# EAGLE schematic Faulty TL072 detector (EAGLE 7.6.0)
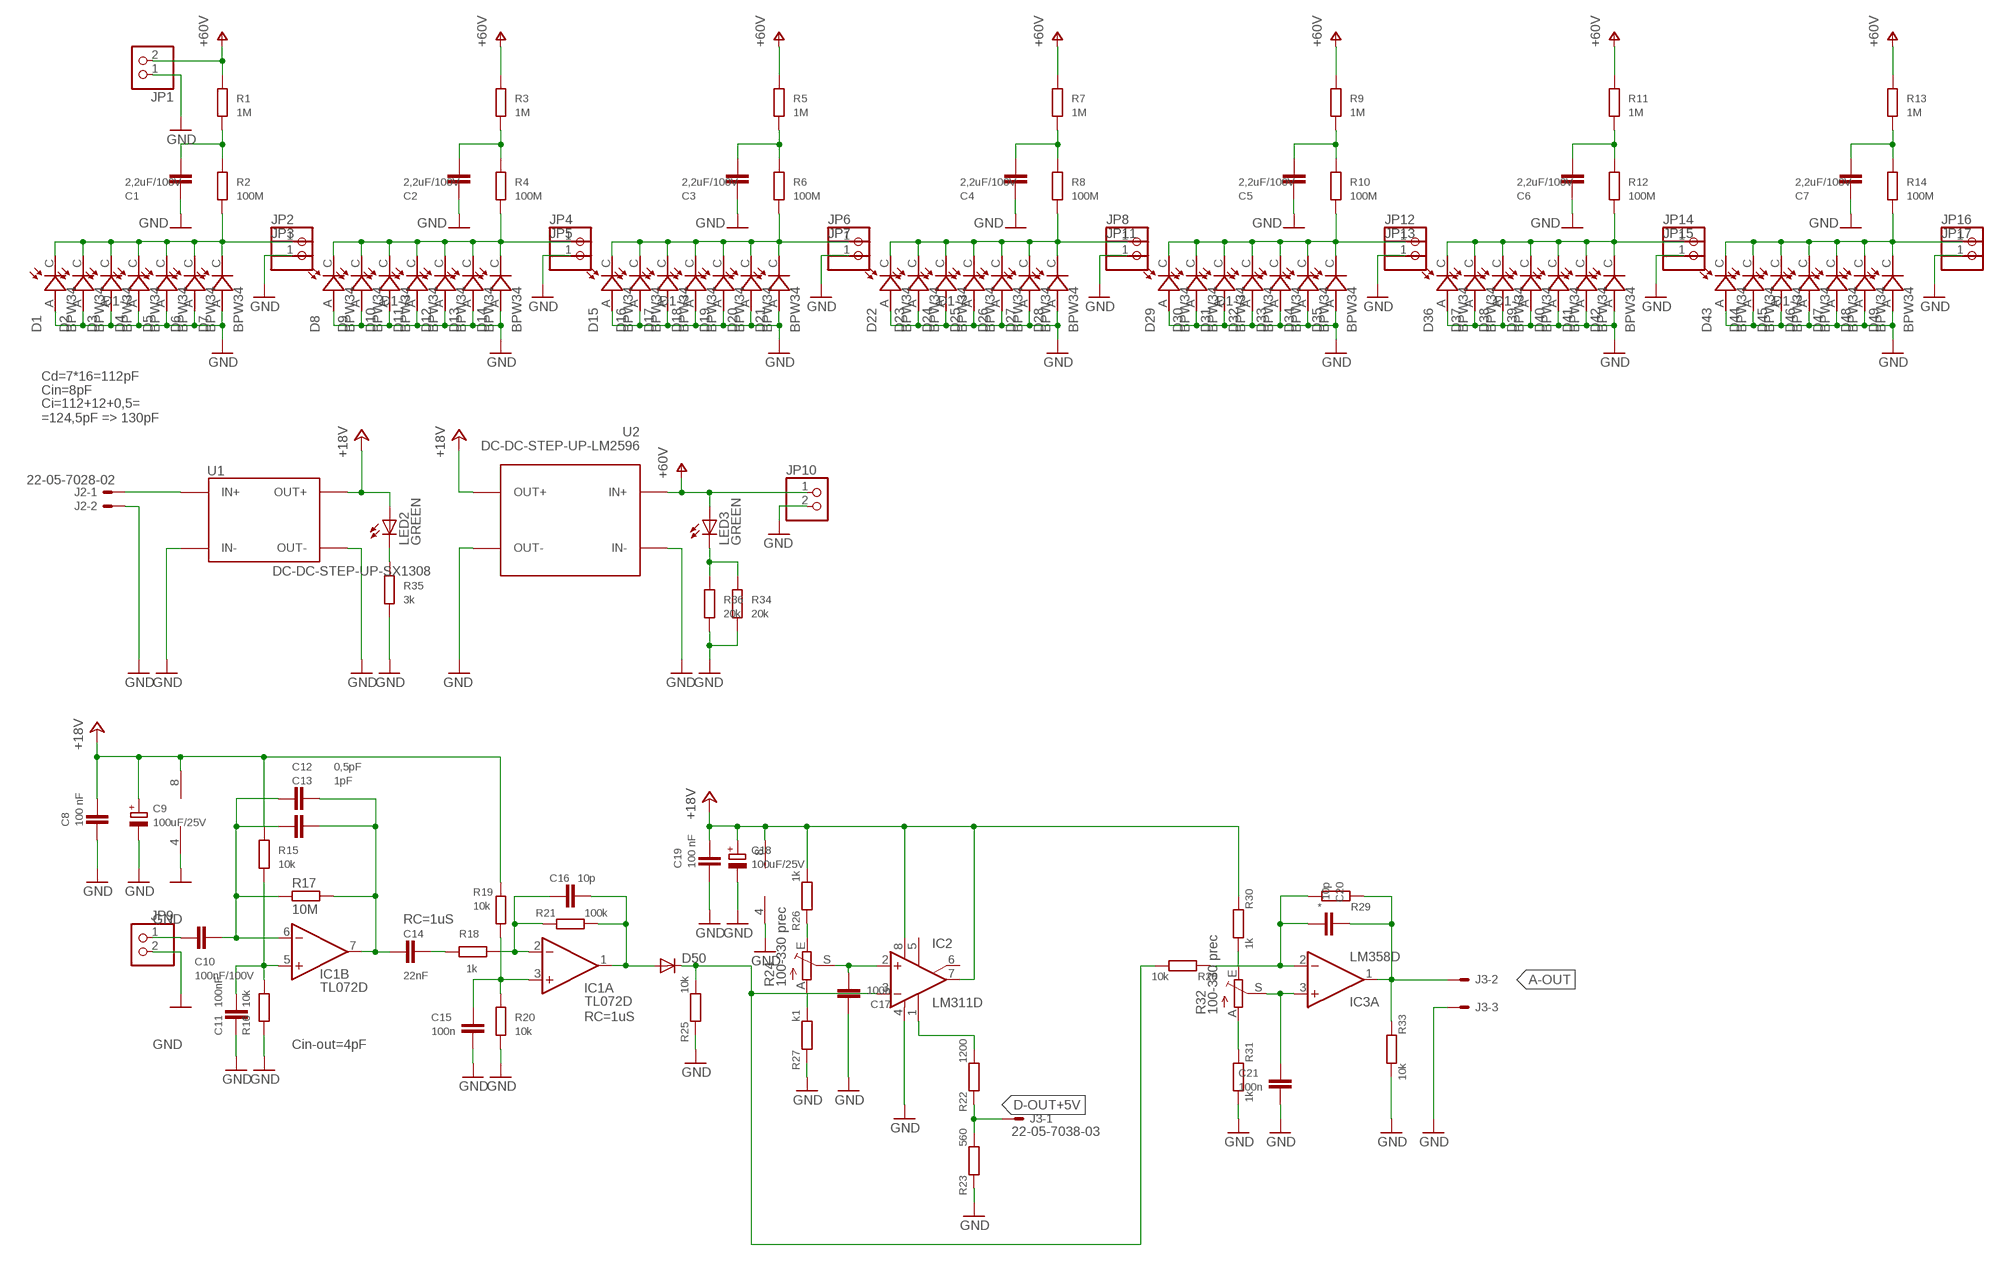
[diagram p0: schematic, sheet 1]

## Parts
C1  2,2uF/100V  C2824  [2824]
C2  2,2uF/100V  C2824  [2824]
C3  2,2uF/100V  C2824  [2824]
C4  2,2uF/100V  C2824  [2824]
C5  2,2uF/100V  C2824  [2824]
C6  2,2uF/100V  C2824  [2824]
C7  2,2uF/100V  C2824  [2824]
C8  100 nF  C-EUC0805  [C0805]
C9  100uF/25V  CPOL-EUSMCD  [SMC_D]
C10  100nF/100V  C-EUC1206  [C1206]
C11  100nF  C-EUC0805  [C0805]
C12  0,5pF  C-EUC0603  [C0603]
C13  1pF  C-EUC0805  [C0805]
C14  22nF  C-EUC0805  [C0805]
C15  100n  C-EUC0805  [C0805]
C16  10p  C-EUC0805  [C0805]
C17  100n  C-EUC0805  [C0805]
C18  100uF/25V  CPOL-EUSMCD  [SMC_D]
C19  100 nF  C-EUC0805  [C0805]
C20  10p  C-EUC0805  [C0805]
C21  100n  C-EUC0805  [C0805]
D1  BPW34  [PHODET_BPW34]
D2  BPW34  [PHODET_BPW34]
D3  BPW34  [PHODET_BPW34]
D4  BPW34  [PHODET_BPW34]
D5  BPW34  [PHODET_BPW34]
D6  BPW34  [PHODET_BPW34]
D7  BPW34  [PHODET_BPW34]
D8  BPW34  [PHODET_BPW34]
D9  BPW34  [PHODET_BPW34]
D10  BPW34  [PHODET_BPW34]
D11  BPW34  [PHODET_BPW34]
D12  BPW34  [PHODET_BPW34]
D13  BPW34  [PHODET_BPW34]
D14  BPW34  [PHODET_BPW34]
D15  BPW34  [PHODET_BPW34]
D16  BPW34  [PHODET_BPW34]
D17  BPW34  [PHODET_BPW34]
D18  BPW34  [PHODET_BPW34]
D19  BPW34  [PHODET_BPW34]
D20  BPW34  [PHODET_BPW34]
D21  BPW34  [PHODET_BPW34]
D22  BPW34  [PHODET_BPW34]
D23  BPW34  [PHODET_BPW34]
D24  BPW34  [PHODET_BPW34]
D25  BPW34  [PHODET_BPW34]
D26  BPW34  [PHODET_BPW34]
D27  BPW34  [PHODET_BPW34]
D28  BPW34  [PHODET_BPW34]
D29  BPW34  [PHODET_BPW34]
D30  BPW34  [PHODET_BPW34]
D31  BPW34  [PHODET_BPW34]
D32  BPW34  [PHODET_BPW34]
D33  BPW34  [PHODET_BPW34]
D34  BPW34  [PHODET_BPW34]
D35  BPW34  [PHODET_BPW34]
D36  BPW34  [PHODET_BPW34]
D37  BPW34  [PHODET_BPW34]
D38  BPW34  [PHODET_BPW34]
D39  BPW34  [PHODET_BPW34]
D40  BPW34  [PHODET_BPW34]
D41  BPW34  [PHODET_BPW34]
D42  BPW34  [PHODET_BPW34]
D43  BPW34  [PHODET_BPW34]
D44  BPW34  [PHODET_BPW34]
D45  BPW34  [PHODET_BPW34]
D46  BPW34  [PHODET_BPW34]
D47  BPW34  [PHODET_BPW34]
D48  BPW34  [PHODET_BPW34]
D49  BPW34  [PHODET_BPW34]
D50  DIODE-SOD323-W  [SOD323-W]
IC1  TL072D  [SO08]
IC2  LM311D  [SO08]
IC3  LM358D  [SO08]
J2  22-05-7028-02  [7395-02]
J3  22-05-7038-03  [7395-03]
JP1  PINHD-1X2  [1X02]
JP2  PINHD-1X1  [1X01]
JP3  PINHD-1X1  [1X01]
JP4  PINHD-1X1  [1X01]
JP5  PINHD-1X1  [1X01]
JP6  PINHD-1X1  [1X01]
JP7  PINHD-1X1  [1X01]
JP8  PINHD-1X1  [1X01]
JP9  PINHD-1X2  [1X02]
JP10  PINHD-1X2  [1X02]
JP11  PINHD-1X1  [1X01]
JP12  PINHD-1X1  [1X01]
JP13  PINHD-1X1  [1X01]
JP14  PINHD-1X1  [1X01]
JP15  PINHD-1X1  [1X01]
JP16  PINHD-1X1  [1X01]
JP17  PINHD-1X1  [1X01]
LED2  GREEN  LEDCHIPLED_1206  [CHIPLED_1206]
LED3  GREEN  LEDCHIPLED_1206  [CHIPLED_1206]
R1  1M  R-EU_M0805  [M0805]
R2  100M  R-EU_R0805  [R0805]
R3  1M  R-EU_M0805  [M0805]
R4  100M  R-EU_R0805  [R0805]
R5  1M  R-EU_M0805  [M0805]
R6  100M  R-EU_R0805  [R0805]
R7  1M  R-EU_M0805  [M0805]
R8  100M  R-EU_R0805  [R0805]
R9  1M  R-EU_M0805  [M0805]
R10  100M  R-EU_R0805  [R0805]
R11  1M  R-EU_M0805  [M0805]
R12  100M  R-EU_R0805  [R0805]
R13  1M  R-EU_M0805  [M0805]
R14  100M  R-EU_R0805  [R0805]
R15  10k  R-EU_R0805  [R0805]
R16  10k  R-EU_R0805  [R0805]
R17  10M  R-EU_R0805  [R0805]
R18  1k  R-EU_R0805  [R0805]
R19  10k  R-EU_R0805  [R0805]
R20  10k  R-EU_R0805  [R0805]
R21  100k  R-EU_R0805  [R0805]
R22  1200  R-EU_R0805  [R0805]
R23  560  R-EU_R0805  [R0805]
R24  100-330 prec  TRIM_EU-SP19L  [SP19L]
R25  10k  R-EU_R0805  [R0805]
R26  1k  R-EU_R0805  [R0805]
R27  k1  R-EU_R0805  [R0805]
R28  10k  R-EU_R0805  [R0805]
R29  *  R-EU_R0805  [R0805]
R30  1k  R-EU_R0805  [R0805]
R31  1k  R-EU_R0805  [R0805]
R32  100-330 prec  TRIM_EU-SP19L  [SP19L]
R33  10k  R-EU_R0805  [R0805]
R34  20k  R-EU_R0805  [R0805]
R35  3k  R-EU_R0805  [R0805]
R36  20k  R-EU_R0805  [R0805]
U1  DC-DC-STEP-UP-SX1308  [DC-DC-STEP-UP-SX1308]
U2  DC-DC-STEP-UP-LM2596  DC-DC-STEP-DOWN-LM2596  [DC-DC-STEP-DOWN-LM2596]

## Nets
+18V: C8.1 C9.+ C18.+ C19.1 IC1.8(P:V+) IC2.7(OUT) IC2.8(V+) IC3.8(P:V+) LED2.A R15.1 R19.1 R26.1 R30.2 U1.OUT+
+24V: U2.OUT+ ; supply symbol labelled +18V
+60: JP1.2 R1.1 R3.1 R5.1 R7.1 R9.1 R11.1 R13.1 ; supply symbol labelled +60V
+60V: JP10.1 LED3.A U2.IN+
A-OUT: C20.2 IC3.1(A:OUT) J3.2 R29.2 R33.2
D-OUT+5V: J3.1 R22.2 R23.1
GND: C1.2 C2.2 C3.2 C4.2 C5.2 C6.2 C7.2 C8.2 C9.- C11.1 C15.1 C17.2 C18.- C19.2 C21.1 D1.A D2.A D3.A D4.A D5.A D6.A D7.A D8.A D9.A D10.A D11.A D12.A D13.A D14.A D15.A D16.A D17.A D18.A D19.A D20.A D21.A D22.A D23.A D24.A D25.A D26.A D27.A D28.A D29.A D30.A D31.A D32.A D33.A D34.A D35.A D36.A D37.A D38.A D39.A D40.A D41.A D42.A D43.A D44.A D45.A D46.A D47.A D48.A D49.A IC1.4(P:V-) IC2.4(V-) IC3.4(P:V-) J2.2 J3.3 JP1.1 JP3.1 JP5.1 JP7.1 JP9.2 JP10.2 JP11.1 JP13.1 JP15.1 JP17.1 R16.2 R20.2 R23.2 R25.2 R27.2 R31.1 R33.1 R34.2 R35.2 R36.2 U1.IN- U1.OUT- U2.IN- U2.OUT-
N$1: C11.2 IC1.5(B:+IN) R15.2 R16.1
N$3: C12.1 C13.1 C14.1 IC1.7(B:OUT) R17.1
N$4: J2.1 U1.IN+
N$5: C1.1 R1.2 R2.1
N$6: C15.2 IC1.3(A:+IN) R19.2 R20.1
N$7: C14.2 R18.2
N$8: C10.2 C12.2 C13.2 IC1.6(B:-IN) R17.2
N$9: C16.2 IC1.2(A:-IN) R18.1 R21.2
N$10: C16.1 D50.A IC1.1(A:OUT) R21.1
N$12: C10.1 JP9.1
N$13: C2.1 R3.2 R4.1
N$14: C3.1 R5.2 R6.1
N$15: C4.1 R7.2 R8.1
N$16: C5.1 R9.2 R10.1
N$17: C6.1 R11.2 R12.1
N$18: C7.1 R13.2 R14.1
N$22: D50.C IC2.3(-IN) R25.1 R28.1
N$23: IC2.1(GND) R22.1
N$24: C20.1 IC3.2(A:-IN) R28.2 R29.1
N$25: C17.1 IC2.2(+IN) R24.S
N$26: R24.E R26.2
N$27: R24.A R27.1
N$29: R30.1 R32.E
N$30: R31.2 R32.A
N$31: C21.2 IC3.3(A:+IN) R32.S
N$32: LED2.C R35.1
N$34: LED3.C R34.1 R36.1
OUT: D1.C D2.C D3.C D4.C D5.C D6.C D7.C JP2.1 R2.2
OUT1: D8.C D9.C D10.C D11.C D12.C D13.C D14.C JP4.1 R4.2
OUT2: D15.C D16.C D17.C D18.C D19.C D20.C D21.C JP6.1 R6.2
OUT3: D22.C D23.C D24.C D25.C D26.C D27.C D28.C JP8.1 R8.2
OUT4: D29.C D30.C D31.C D32.C D33.C D34.C D35.C JP12.1 R10.2
OUT5: D36.C D37.C D38.C D39.C D40.C D41.C D42.C JP14.1 R12.2
OUT6: D43.C D44.C D45.C D46.C D47.C D48.C D49.C JP16.1 R14.2
Unconnected: IC2.5(ON) IC2.6(ON/STR) IC3.5(B:+IN) IC3.6(B:-IN) IC3.7(B:OUT)

## Notes on the sheet
- D1-7 | D1-7 | D1-7 | D1-7 | D1-7 | D1-7 | D1-7
- Cd=7*16=112pF
- Cin=8pF
- Ci=112+12+0,5=
  =124,5pF => 130pF
- RC=1uS
- RC=1uS
- Cin-out=4pF

## Library data of the parts
C1-C7 = capacitor-wima:C: CAPACITOR naming: grid - package width
C8 C19 = resistor:C-EU: CAPACITOR, European symbol
C9 C18 = rcl:CPOL-EU: POLARIZED CAPACITOR, European symbol
C10-C17 C20 C21 = rcl:C-EU: CAPACITOR, European symbol
D1-D49 = BPW34:BPW34: PIN IR photodiode; DIL; 400-1100nm; 150mW; 60°; λp max:; AVAILABILITY: Good; DESCRIPTION: 950 nm 100 ns %C2%B1 65%C2%B0 Wide Angle Half Sensitivity TO-5 Silicon PIN Photodiode; MF: Vishay; MP: BPW34; PACKAGE: SMD-2 Vishay; PRICE: 0.62 USD
D50 = diode:DIODE-: DIODE
IC1 = linear:TL072: OP AMP
IC2 = linear:LM311: COMPARATOR
IC3 = linear:LM358: OP AMP also LM158; LM258; LM2904 Source: http://cache.national.com/ds/LM/LM158.pdf
J2 = con-molex:22-?-02: CONNECTOR wire to board 2.54 mm (.1 inch) pitch header; OC_FARNELL: 9731601; OC_NEWARK: unknown
J3 = con-molex:22-?-03: CONNECTOR wire to board 2.54 mm (.1 inch) pitch header; OC_FARNELL: unknown; OC_NEWARK: unknown
JP1 JP9 JP10 = pinhead:PINHD-1X2: PIN HEADER
JP2-JP8 JP11-JP17 = pinhead:PINHD-1X1: PIN HEADER
LED2 LED3 = led:LED: LED OSRAM: - CHIPLED LG R971, LG N971, LY N971, LG Q971, LY Q971, LO R971, LY R971 LH N974, LH R974 LS Q976, LO Q976, LY Q976 LO Q996 - Hyper CHIPLED LW Q18S LB Q993, LB Q99A, LB R99A - SideLED LS A670, LO A670, LY A670, LG A670, LP A670 LB A673, LV A673, LT A673, LW A673 LH A674 LY A675 LS A676, LA A676, LO A676, LY A676, LW A676 LS A679, LY A679, LG A679 - Hyper Micro SIDELED® LS Y876, LA Y876, LO Y876, LY Y876 LT Y87S - SmartLED LW L88C, LW L88S LB L89C, LB L89S, LG L890 LS L89K, LO L89K, LY L89K LS L896, LA L896, LO L896, LY L896 - TOPLED LS T670, LO T670, LY T670, LG T670, LP T670 LSG T670, LSP T670, LSY T670, LOP T670, LYG T670 LG T671, LOG T671, LSG T671 LB T673, LV T673, LT T673, LW T673 LH T674 LS T676, LA T676, LO T676, LY T676, LB T676, LH T676, LSB T676, LW T676 LB T67C, LV T67C, LT T67C, LS T67K, LO T67K, LY T67K, LW E67C LS E67B, LA E67B, LO E67B, LY E67B, LB E67C, LV E67C, LT E67C LW T67C LS T679, LY T679, LG T679 LS T770, LO T770, LY T770, LG T770, LP T770 LB T773, LV T773, LT T773, LW T773 LH T774 LS E675, LA E675, LY E675, LS T675 LS T776, LA T776, LO T776, LY T776, LB T776 LHGB T686 LT T68C, LB T68C - Hyper Mini TOPLED® LB M676 - Mini TOPLED Santana® LG M470 LS M47K, LO M47K, LY M47K Source: http://www.osram.convergy.de LUXEON: - LUMILED® LXK2-PW12-R00, LXK2-PW12-S00, LXK2-PW14-U00, LXK2-PW14-V00 LXK2-PM12-R00, LXK2-PM12-S00, LXK2-PM14-U00 LXK2-PE12-Q00, LXK2-PE12-R00, LXK2-PE12-S00, LXK2-PE14-T00, LXK2-PE14-U00 LXK2-PB12-K00, LXK2-PB12-L00, LXK2-PB12-M00, LXK2-PB14-N00, LXK2-PB14-P00, LXK2-PB14-Q00 LXK2-PR12-L00, LXK2-PR12-M00, LXK2-PR14-Q00, LXK2-PR14-R00 LXK2-PD12-Q00, LXK2-PD12-R00, LXK2-PD12-S00 LXK2-PH12-R00, LXK2-PH12-S00 LXK2-PL12-P00, LXK2-PL12-Q00, LXK2-PL12-R00 Source: www.luxeon.com KINGBRIGHT: KA-3528ASYC Source: www.kingbright.com
R1-R23 R25-R31 R33-R36 = rcl:R-EU_: RESISTOR, European symbol
R24 R32 = pot:TRIM_EU-: POTENTIOMETER
U1 = diy-modules:DC-DC-STEP-UP-SX1308
U2 = diy-modules:DC-DC-STEP-DOWN-LM2596: DC/DC Step-Down Regulator based on LM2596-ADJ chip LM2596 datasheet available here: http://www.ti.com/lit/ds/symlink/lm2596.pdf Click here to find device on ebay.com <http://www.ebay.com/sch/lm2596+power+regulator>